# Altium project Reboostv2.PrjPcb (part 2 of 2)
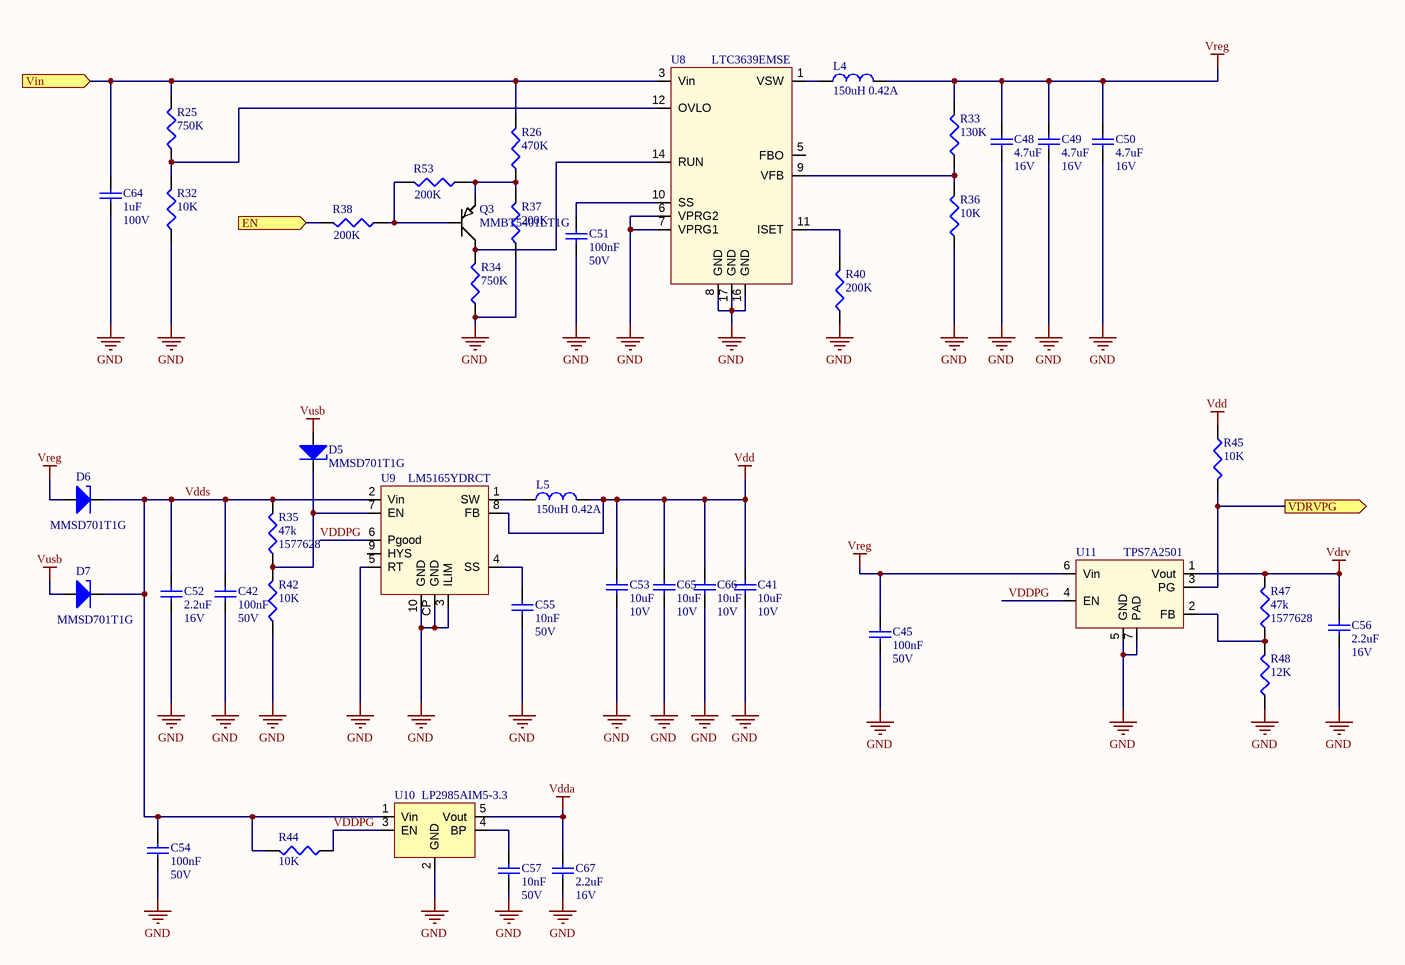
[diagram p9: ReboostV2_Power.SchDoc]

## Nets that join several sheets
GND: ReboostV2_toplevel (8 pins), ReboostV2_CAN (C31.1 D4.3 U6.4), ReboostV2_USB (9 pins), ReboostV2_MC (19 pins), ReboostV2_Phase (10 pins), PowerElectronics/ILS (C2_ILS.1 C3_ILS.1 R6_ILS.1 U1_ILS.6), PowerElectronics/IHS (C2_IHS.1 C3_IHS.1 R6_IHS.1 U1_IHS.6), PowerElectronics/VLS (L7_VLS.3 L7_VLS.4 R49_VLS.2), PowerElectronics/VHS (L7_VHS.3 L7_VHS.4 R49_VHS.2), ReboostV2_Bridge (14 pins), ReboostV2_Power (36 pins)
Vdd: ReboostV2_toplevel (R1.2), ReboostV2_CAN (C31.2 U6.1), ReboostV2_MC (11 pins), ReboostV2_Phase (R18.2 R19.2), ReboostV2_Bridge (C60.2 U5.7), ReboostV2_Power (7 pins)
Vdda: ReboostV2_MC (C12.2 C13.2 U3.21), PowerElectronics/ILS (C2_ILS.2 U1_ILS.3 U1_ILS.7), PowerElectronics/IHS (C2_IHS.2 U1_IHS.3 U1_IHS.7), ReboostV2_Power (C67.2 U10.5)
Vdrv: ReboostV2_Bridge (D2.1 D3.1), ReboostV2_Power (C56.2 R47.2 U11.1)
Vusb: ReboostV2_USB (5 pins), ReboostV2_Power (D5.1 D7.1)
_N: ReboostV2_MC (U3.10), PowerElectronics/IHS (C4_IHS.2 R10_IHS.2 U1_IHS.5)
_N: ReboostV2_MC (U3.27), PowerElectronics/ILS (C4_ILS.2 R10_ILS.2 U1_ILS.5)
_P: ReboostV2_MC (U3.11), PowerElectronics/IHS (C1_IHS.2 R8_IHS.2 U1_IHS.4)
_P: ReboostV2_MC (U3.28), PowerElectronics/ILS (C1_ILS.2 R8_ILS.2 U1_ILS.4)
CANRX: ReboostV2_CAN (U6.3), ReboostV2_MC (U3.43)
CANTX: ReboostV2_CAN (U6.2), ReboostV2_MC (U3.44)
DREN: ReboostV2_MC (U3.42), ReboostV2_Bridge (U5.5)
HI: ReboostV2_MC (U4.7), ReboostV2_Bridge (U5.3)
HSS: ReboostV2_Phase (L2.1), ReboostV2_Bridge (6 pins)
LED0: ReboostV2_toplevel (R5.2), ReboostV2_MC (U3.4)
LED1: ReboostV2_toplevel (R4.2), ReboostV2_MC (U3.3)
LED2: ReboostV2_toplevel (R3.2), ReboostV2_MC (U3.2)
LED3: ReboostV2_toplevel (R2.2), ReboostV2_MC (U3.47)
LO: ReboostV2_MC (U4.3), ReboostV2_Bridge (U5.2)
NetD4_4: ReboostV2_toplevel (R41.1 S1.1), ReboostV2_CAN (D4.4)
NetR38_2: ReboostV2_toplevel (R39.2 R41.2 S1.3 S1.4), ReboostV2_Power (R38.2)
RX: ReboostV2_USB (U2.21), ReboostV2_MC (U3.40)
Tamb: ReboostV2_MC (U3.30), ReboostV2_Phase (C21.2 R19.1 R21.2)
Tsink: ReboostV2_MC (U3.31), ReboostV2_Phase (C20.2 R18.1 R20.2)
TX: ReboostV2_USB (U2.20), ReboostV2_MC (U3.39)
Vb: ReboostV2_toplevel (L1.1), ReboostV2_Phase (6 pins), PowerElectronics/VHS (R12_VHS.2), ReboostV2_Bridge (6 pins), ReboostV2_Power (C64.2 R25.2 R26.2 U8.3)
VDRVPG: ReboostV2_MC (U3.45), ReboostV2_Power (R45.2 U11.3)
VHN: ReboostV2_toplevel (J1.4), PowerElectronics/IHS (R6_IHS.2)
VHS: ReboostV2_MC (U3.15), PowerElectronics/VHS (L7_VHS.2)
VLN: ReboostV2_toplevel (J1.1), ReboostV2_Phase (C34.2 C35.1), PowerElectronics/ILS (R6_ILS.2)
VLP: ReboostV2_toplevel (J1.2), ReboostV2_Phase (C34.1 C35.2 L2.2), PowerElectronics/VLS (R12_VLS.2)
VLS: ReboostV2_MC (U3.9), PowerElectronics/VLS (L7_VLS.2)